# EAGLE schematic The Breadboard Version (EAGLE 9.6.0)
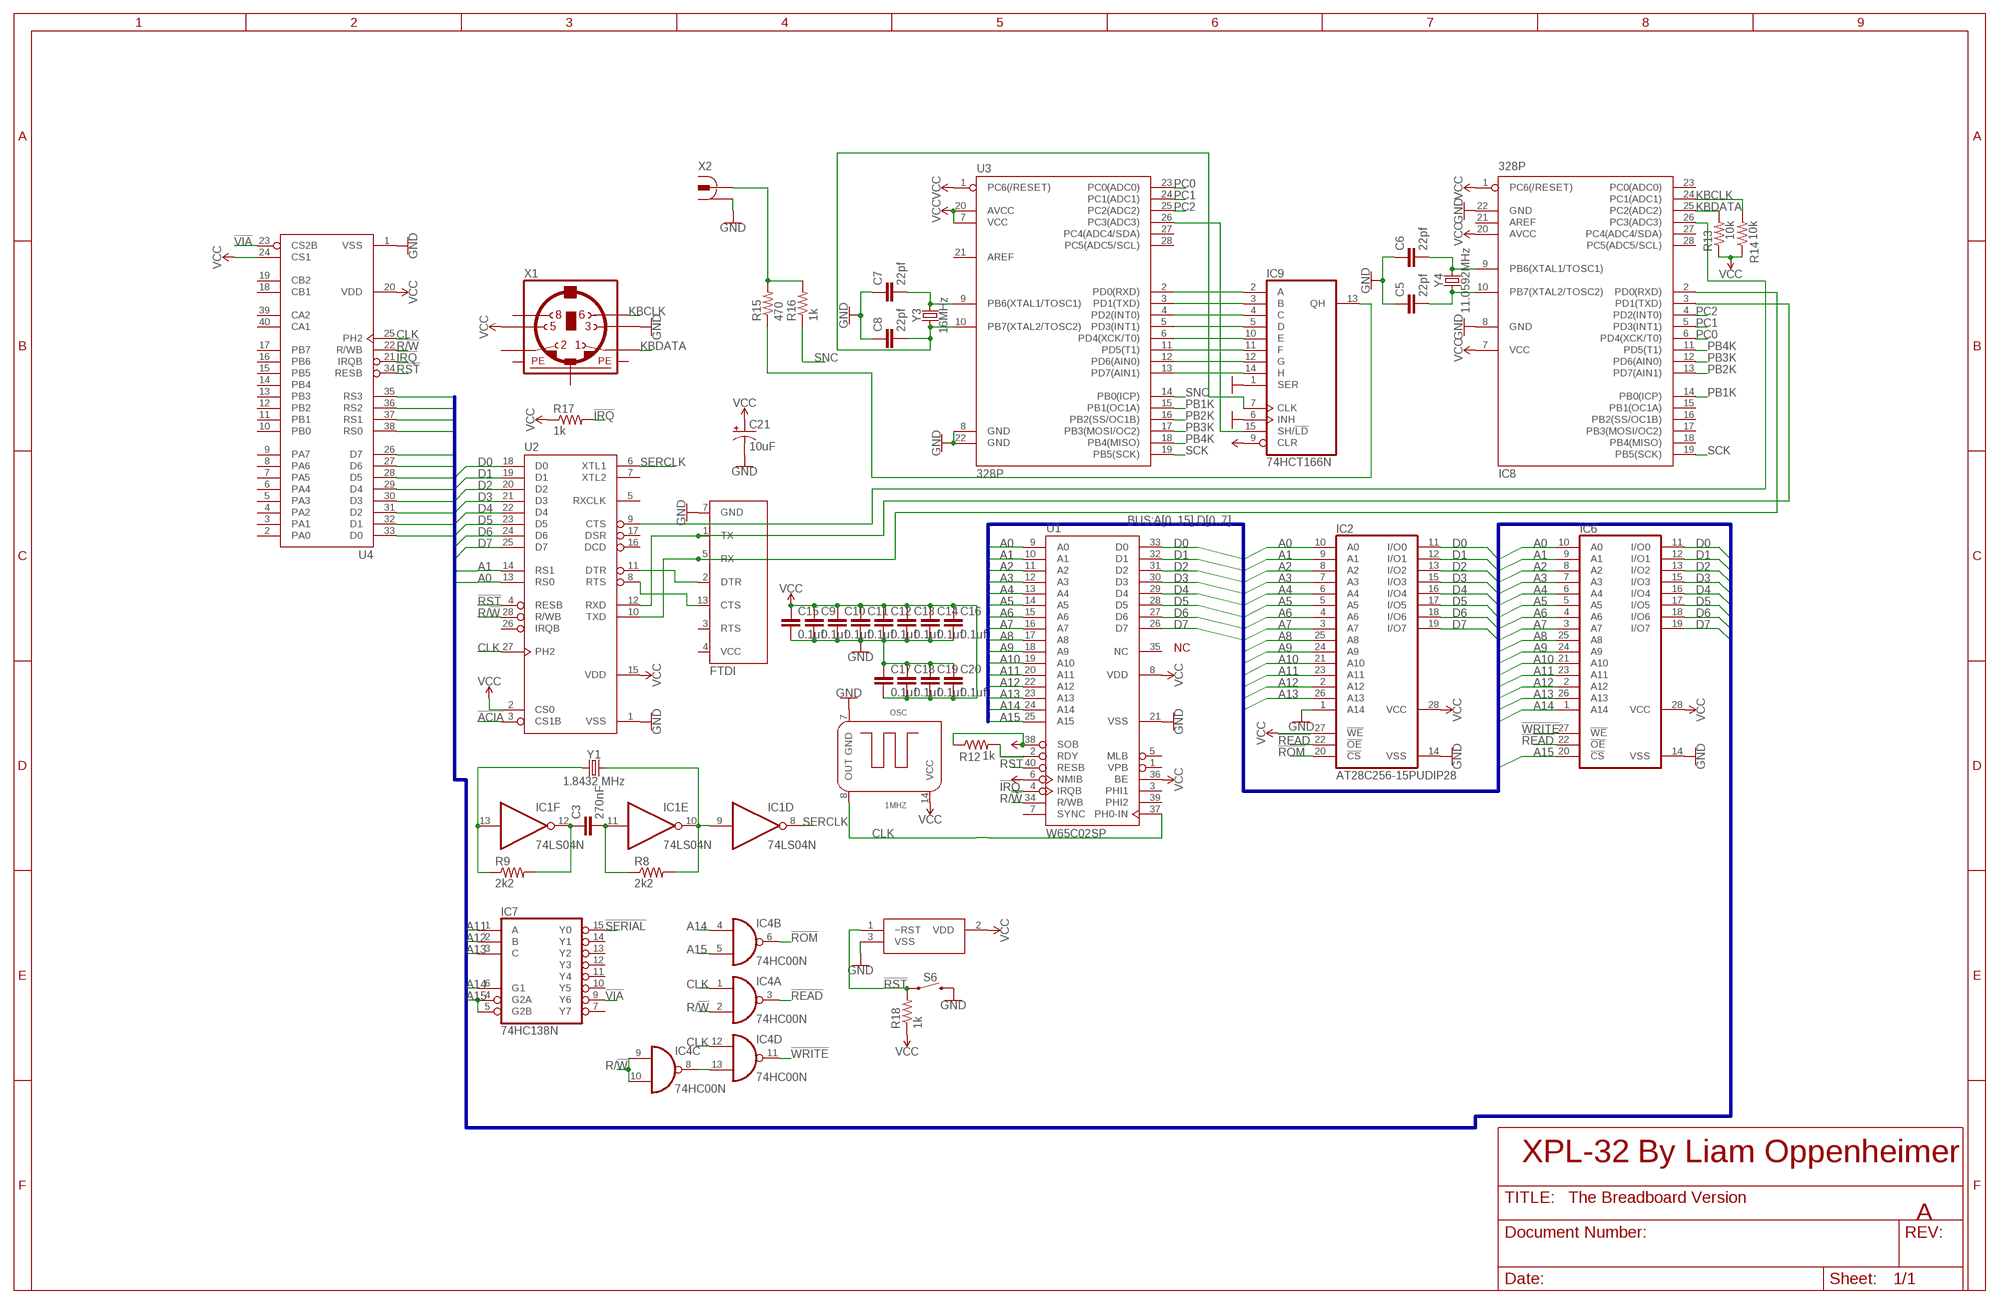
[diagram p0: schematic, sheet 1]

## Parts
1MHZ  OSC  [OSCCAN]
C3  270nF  C-EU025-025X050  [C025-025X050]
C5  22pf  C-EU025-025X050  [C025-025X050]
C6  22pf  C-EU025-025X050  [C025-025X050]
C7  22pf  C-EU025-025X050  [C025-025X050]
C8  22pf  C-EU025-025X050  [C025-025X050]
C9  0.1uf  C-EU025-025X050  [C025-025X050]
C10  0.1uf  C-EU025-025X050  [C025-025X050]
C11  0.1uf  C-EU025-025X050  [C025-025X050]
C12  0.1uf  C-EU025-025X050  [C025-025X050]
C13  0.1uf  C-EU025-025X050  [C025-025X050]
C14  0.1uf  C-EU025-025X050  [C025-025X050]
C15  0.1uf  C-EU025-025X050  [C025-025X050]
C16  0.1uf  C-EU025-025X050  [C025-025X050]
C17  0.1uf  C-EU025-025X050  [C025-025X050]
C18  0.1uf  C-EU025-025X050  [C025-025X050]
C19  0.1uf  C-EU025-025X050  [C025-025X050]
C20  0.1uf  C-EU025-025X050  [C025-025X050]
C21  10uF  CPOL-USE2.5-7  [E2,5-7]
IC1  74LS04N  [DIL14]
IC2  AT28C256-15PUDIP28  [DIP-28]
IC4  74HC00N  [DIL14]
IC6  62256P  [DIL28-6]
IC7  74HC138N  [DIL16]
IC8  328P  MEGA8-P  [DIL28-3]
IC9  74HCT166N  74LS166N  [DIL16]
IC10  MCP120-450DI_TO  [TO127P254X495-3]
R8  2k2  R-US_0204/7  [0204/7]
R9  2k2  R-US_0204/7  [0204/7]
R12  1k  R-US_0204/7  [0204/7]
R13  10k  R-US_0204/7  [0204/7]
R14  10k  R-US_0204/7  [0204/7]
R15  470  R-US_0204/7  [0204/7]
R16  1k  R-US_0204/7  [0204/7]
R17  1k  R-US_0204/7  [0204/7]
R18  1k  R-US_0204/7  [0204/7]
S6  MOMENTARY-SWITCH-SPST-PTH-6.0MM  [TACTILE_SWITCH_PTH_6.0MM]
U1  W65C02SP  [DIP-40]
U2  G65SC51P  [DIP-28]
U3  328P  ATMEGA328P_PDIP  [DIP28]
U4  G65SC22P  [DIP-40]
U6  FTDI  [FTDI]
X1  MINI_DIN_6  [M_DIN6]
X2  736880-49  [736880-49]
Y1  1.8432 MHz  CRYSTALPTH-HC49UV  [HC49U]
Y3  16MHz  CRYSTALPTH-HC49UV  [HC49U]
Y4  11.0592MHz  CRYSTALPTH-HC49UV  [HC49U]

## Nets
!ACIA: U2.3(CS1B)
!IRQ: R17.2 U1.4(IRQB) U4.21(IRQB)
!READ: IC2.22(!OE) IC4.3(A:O) IC6.22(!OE)
!ROM: IC2.20(!CS) IC4.6(B:O)
!RST: IC10.1(~RST) R18.2 S6.1 U1.40(RESB) U2.4(RESB) U4.34(RESB)
!SERIAL: IC7.15(Y0)
!VIA: IC7.9(Y6) U4.23(CS2B)
!WRITE: IC4.11(D:O) IC6.27(!WE)
A0: IC2.10(A0) IC6.10(A0) U1.9(A0) U2.13(RS0) U4.38(RS0)
A1: IC2.9(A1) IC6.9(A1) U1.10(A1) U2.14(RS1) U4.37(RS1)
A2: IC2.8(A2) IC6.8(A2) U1.11(A2) U4.36(RS2)
A3: IC2.7(A3) IC6.7(A3) U1.12(A3) U4.35(RS3)
A4: IC2.6(A4) IC6.6(A4) U1.13(A4)
A5: IC2.5(A5) IC6.5(A5) U1.14(A5)
A6: IC2.4(A6) IC6.4(A6) U1.15(A6)
A7: IC2.3(A7) IC6.3(A7) U1.16(A7)
A8: IC2.25(A8) IC6.25(A8) U1.17(A8)
A9: IC2.24(A9) IC6.24(A9) U1.18(A9)
A10: IC2.21(A10) IC6.21(A10) U1.19(A10)
A11: IC2.23(A11) IC6.23(A11) IC7.1(A) U1.20(A11)
A12: IC2.2(A12) IC6.2(A12) IC7.2(B) U1.22(A12)
A13: IC2.26(A13) IC6.26(A13) IC7.3(C) U1.23(A13)
A14: IC4.4(B:I0) IC6.1(A14) IC7.6(G1) U1.24(A14)
A15: IC4.5(B:I1) IC6.20(!CS) IC7.4(G2A) IC7.5(G2B) U1.25(A15)
CLK: 1MHZ.8(OUT) IC4.1(A:I0) IC4.12(D:I0) U1.37(PH0-IN) U2.27(PH2) U4.25(PH2)
D0: IC2.11(I/O0) IC6.11(I/O0) U1.33(D0) U2.18(D0) U4.33(D0)
D1: IC2.12(I/O1) IC6.12(I/O1) U1.32(D1) U2.19(D1) U4.32(D1)
D2: IC2.13(I/O2) IC6.13(I/O2) U1.31(D2) U2.20(D2) U4.31(D2)
D3: IC2.15(I/O3) IC6.15(I/O3) U1.30(D3) U2.21(D3) U4.30(D3)
D4: IC2.16(I/O4) IC6.16(I/O4) U1.29(D4) U2.22(D4) U4.29(D4)
D5: IC2.17(I/O5) IC6.17(I/O5) U1.28(D5) U2.23(D5) U4.28(D5)
D6: IC2.18(I/O6) IC6.18(I/O6) U1.27(D6) U2.24(D6) U4.27(D6)
D7: IC2.19(I/O7) IC6.19(I/O7) U1.26(D7) U2.25(D7) U4.26(D7)
GND: 1MHZ.7(GND) C5.1 C6.1 C7.1 C8.1 C9.2 C10.2 C11.2 C12.2 C13.2 C14.2 C15.2 C16.2 C17.1 C18.1 C19.1 C20.1 C21.- IC2.1(A14) IC2.14(VSS) IC6.14(VSS) IC8.8(GND) IC8.22(GND) IC9.1(SER) IC9.6(INH) IC10.3(VSS) S6.3 U1.21(VSS) U2.1(VSS) U3.8(GND) U3.22(GND) U4.1(VSS) U6.7(GND) X1.3 X2.1 X2.1@1 X2.1@2
KBCLK: IC8.24(PC1(ADC1)) R14.2 X1.6
KBDATA: IC8.25(PC2(ADC2)) R13.2 X1.1
N$7: IC4.8(C:O) IC4.13(D:I1)
N$12: IC1.9(D:I) IC1.10(E:O) R8.2 Y1.2
N$14: IC8.3(PD1(TXD)) U2.12(RXD) U6.1(TX)
N$15: C3.2 IC1.11(E:I) R8.1
N$17: U2.11(DTR) U6.2(DTR)
N$20: C3.1 IC1.12(F:O) R9.2
N$21: IC1.13(F:I) R9.1 Y1.1
N$22: R12.2 U1.2(RDY)
N$27: U2.8(RTS) U6.13(CTS)
N$31: C6.2 IC8.9(PB6(XTAL1/TOSC1)) Y4.2
N$32: C5.2 IC8.10(PB7(XTAL2/TOSC2)) Y4.1
N$33: C7.2 U3.9(PB6(XTAL1/TOSC1)) Y3.2
N$34: C8.2 IC9.7(CLK) U3.10(PB7(XTAL2/TOSC2)) Y3.1
N$35: IC8.26(PC3(ADC3)) U2.9(CTS)
N$36: IC9.15(SH/!LD) U3.26(PC3(ADC3))
N$40: R15.2 R16.2 X2.2
N$63: IC9.2(A) U3.2(PD0(RXD))
N$64: IC9.3(B) U3.3(PD1(TXD))
N$65: IC9.4(C) U3.4(PD2(INT0))
N$66: IC9.5(D) U3.5(PD3(INT1))
N$67: IC9.10(E) U3.6(PD4(XCK/T0))
N$68: IC9.11(F) U3.11(PD5(T1))
N$69: IC9.12(G) U3.12(PD6(AIN0))
N$70: IC9.14(H) U3.13(PD7(AIN1))
N$71: IC9.13(QH) R15.1
N$74: IC8.2(PD0(RXD)) U2.10(TXD) U6.5(RX)
PB1K: IC8.14(PB0(ICP)) U3.15(PB1(OC1A))
PB2K: IC8.13(PD7(AIN1)) U3.16(PB2(SS/OC1B))
PB3K: IC8.12(PD6(AIN0)) U3.17(PB3(MOSI/OC2))
PB4K: IC8.11(PD5(T1)) U3.18(PB4(MISO))
PC0: IC8.6(PD4(XCK/T0)) U3.23(PC0(ADC0))
PC1: IC8.5(PD3(INT1)) U3.24(PC1(ADC1))
PC2: IC8.4(PD2(INT0)) U3.25(PC2(ADC2))
R/!W: IC4.2(A:I1) IC4.9(C:I0) IC4.10(C:I1) U1.34(R/WB) U2.28(R/WB) U4.22(R/WB)
SCK: IC8.19(PB5(SCK)) U3.19(PB5(SCK))
SERCLK: IC1.8(D:O) U2.6(XTL1)
SNC: R16.1 U3.14(PB0(ICP))
VCC: 1MHZ.14(VCC) C9.1 C10.1 C11.1 C12.1 C13.1 C14.1 C15.1 C16.1 C17.2 C18.2 C19.2 C20.2 C21.+ IC2.27(!WE) IC2.28(VCC) IC6.28(VCC) IC8.1(PC6(/RESET)) IC8.7(VCC) IC8.20(AVCC) IC9.9(CLR) IC10.2(VDD) R12.1 R13.1 R14.1 R17.1 R18.1 U1.6(NMIB) U1.8(VDD) U1.36(BE) U1.38(SOB) U2.2(CS0) U2.15(VDD) U3.1(PC6(/RESET)) U3.7(VCC) U3.20(AVCC) U4.20(VDD) U4.24(CS1) X1.5
Unconnected: IC1.1(A:I) IC1.2(A:O) IC1.3(B:I) IC1.4(B:O) IC1.5(C:I) IC1.6(C:O) IC7.7(Y7) IC7.10(Y5) IC7.11(Y4) IC7.12(Y3) IC7.13(Y2) IC7.14(Y1) IC8.15(PB1(OC1A)) IC8.16(PB2(SS/OC1B)) IC8.17(PB3(MOSI/OC2)) IC8.18(PB4(MISO)) IC8.21(AREF) IC8.23(PC0(ADC0)) IC8.27(PC4(ADC4/SDA)) IC8.28(PC5(ADC5/SCL)) U1.1(VPB) U1.3(PHI1) U1.5(MLB) U1.7(SYNC) U1.35(NC) U1.39(PHI2) U2.5(RXCLK) U2.7(XTL2) U2.16(DCD) U2.17(DSR) U2.26(IRQB) U3.21(AREF) U3.27(PC4(ADC4/SDA)) U3.28(PC5(ADC5/SCL)) U4.2(PA0) U4.3(PA1) U4.4(PA2) U4.5(PA3) U4.6(PA4) U4.7(PA5) U4.8(PA6) U4.9(PA7) U4.10(PB0) U4.11(PB1) U4.12(PB2) U4.13(PB3) U4.14(PB4) U4.15(PB5) U4.16(PB6) U4.17(PB7) U4.18(CB1) U4.19(CB2) U4.39(CA2) U4.40(CA1) U6.3(RTS) U6.4(VCC) X1.2 X1.8

## Buses
BUS:A[0..15],D[0..7]

## Notes on the sheet
- FTDI
- XPL-32 | By Liam Oppenheimer
- A

## Power pins joined to a net without a drawn wire
GND: IC1.7(P:GND) IC4.7(P:GND) IC7.8(GND) IC9.8(GND)
PE1: X1.SH1(PE1)
PE2: X1.SH2(PE2)
PE3: X1.SH3(PE3)
VCC: IC1.14(P:VCC) IC4.14(P:VCC) IC7.16(VCC) IC9.16(VCC)

## Library data of the parts
1MHZ = Liam's Inventions:OSC
C3 C5-C20 = rcl:C-EU: CAPACITOR, European symbol; SPICEPREFIX: C
C21 = adafruit:CPOL-US: POLARIZED CAPACITOR, American symbol
IC1 = 74xx-us:74*04: Hex INVERTER
IC2 = SamacSys_Parts:AT28C256-15PU: AT28C256-15PU, Parallel EEPROM Memory 256kbit, Parallel, 150ns 4.5 5.5 V, 28-Pin PDIP Source: Datasheet
IC4 = 74xx-eu:74*00: Quad 2-input NAND gate
IC6 = memory-hitachi:62256P: MEMORY; OC_FARNELL: unknown; OC_NEWARK: unknown
IC7 = 74xx-eu:74*138: 3-line to 8-line DECODER/DEMULTIPLEXER
IC8 = atmel:MEGA8-P: MICROCONTROLLER 8 Kbytes FLASH, 1 kbytes SRAM, 512 bytes EEPROM, USART, 4-channel 10 bit ADC, 2-channel 8 bit ADC Pin compatible with Atmega48, ATMega88, ATMega168 Source: avr.lbr; OC_FARNELL: unknown; OC_NEWARK: unknown
IC9 = 74xx-us:74*166: 8-bit parallel load SHIFT REGISTER
IC10 = SamacSys_Parts:MCP120-450DI_TO: MCU VOLT SUPERVISOR Source: Datasheet; DESCRIPTION: MCU VOLT SUPERVISOR; HEIGHT: mm; MANUFACTURER_NAME: Microchip; MANUFACTURER_PART_NUMBER: MCP120-450DI/TO; MOUSER_PART_NUMBER: 579-MCP120-450DI/TO; MOUSER_PRICE-STOCK: https://www.mouser.co.uk/ProductDetail/Microchip-Technology/MCP120-450DI-TO?qs=sX%2FisSQq3c699aLRZYrX5w%3D%3D
R8 R9 R12-R18 = adafruit:R-US_: RESISTOR, American symbol
S6 = SparkFun-Switches:MOMENTARY-SWITCH-SPST: Momentary Switch (Pushbutton) - SPST Normally-open (NO) SPST momentary switches (buttons, pushbuttons). Variants PTH-12MM - 12mm square, through-hole Momentary Pushbutton Switch - 12mm Square <https://www.sparkfun.com/products/9190> (COM-09190) PTH-6.0MM, PTH-6.0MM-KIT - 6.0mm square, through-hole Mini Pushbutton Switch <https://www.sparkfun.com/products/97> (COM-00097) KIT package intended for soldering kit's - only one side of pads' copper is exposed. PTH-RIGHT-ANGLE-KIT - Right-angle, through-hole Right Angle Tactile Button <https://www.sparkfun.com/products/10791> - Used on SparkFun BigTime Watch Kit <https://www.sparkfun.com/products/11734> SMD-12MM - 12mm square, surface-mount Tactile Button - SMD (12mm) <https://www.sparkfun.com/products/12993> (COM-12993) Used on SparkFun PicoBoard <https://www.sparkfun.com/products/11888> SMD-4.5MM - 4.5mm Square Trackball Switch Used on SparkFun Blackberry Trackballer Breakout <https://www.sparkfun.com/products/13169> SMD-4.6MMX2.8MM - 4.60mm x 2.80mm, surface mount Used on SparkFun SAMD21 Mini Breakout <https://www.sparkfun.com/products/13664> SMD-5.2MM, SMD-5.2-REDUNDANT - 5.2mm square, surface-mount Mini Pushbutton Switch - SMD <https://www.sparkfun.com/products/8720> (COM-08720) Used on Arduino Pro Mini <https://www.sparkfun.com/products/11114> REDUNDANT package connects both switch circuits together SMD-6.0X3.5MM - 6.0 x 3.5mm, surface mount Momentary Reset Switch SMD <https://www.sparkfun.com/products/8229> (COM-08229) SMD-6.2MM-TALL - 6.2mm square, surface mount Tactile Button - SMD (6mm) <https://www.sparkfun.com/products/12992> Used on SparkFun Digital Sandbox <https://www.sparkfun.com/products/12651> SMD-RIGHT-ANGLE - Right-angle, surface mount Used on SparkFun Block for Intel® Edison - Arduino <https://www.sparkfun.com/products/13036>; PROD_ID: SWCH-08441; SF_SKU: COM-00097
U1 = 65xxx:W65C02SP: Western Digital Version
U2 = 65xxx:G65SC51P: California Micro Devices Version
U3 = SparkFun-IC-Microcontroller:ATMEGA328P_PDIP: Atmel 328P Through hole ATMEGA328P uC used in the Arduino 32kb flash, 1k EEPROM, 2k SRAM Datasheet <http://www.sparkfun.com/datasheets/Components/SMD/ATMega328.pdf> SparkFun Products Storefront component: AVR 28 Pin 20MHz 32K 6A/D - ATMega328P <https://www.sparkfun.com/products/9061> (COM-09061) SparkFun Simon Says - Through-Hole Soldering Kit <https://www.sparkfun.com/products/10547> (KIT-10547) SparkFun Learn to Solder - Simon Says <https://www.sparkfun.com/products/13708> (KIT-13708) SparkFun BigTime Watch Kit <https://www.sparkfun.com/products/11734> (KIT-11734) SparkFun ClockIt <https://www.sparkfun.com/products/10930> (KIT-10930) SparkFun Serial Enabled LCD Kit <https://www.sparkfun.com/products/10097> (LCD-10097) SparkFun Simon Tilts - Through Hole Soldering Kit <https://www.sparkfun.com/products/12634> (KIT-12634) SparkFun Frequency Counter Kit <https://www.sparkfun.com/products/10140> (KIT-10140) FabFM Radio Kit <https://www.sparkfun.com/products/11043> (KIT-11043) SparkFun Binary Blaster Kit <https://www.sparkfun.com/products/12037> (KIT-12037) SparkFun Metro-Gnome <https://www.sparkfun.com/products/9236> (KIT-09236) ATmega328 with Arduino Optiboot (Uno) <https://www.sparkfun.com/products/10524> (DEV-10524); PROD_ID: IC-09136
U4 = 65xxx:G65SC22P: California Micro Devices Version
U6 = Liam's Inventions:FTDI
X1 = mini_din:MINI_DIN_6
X2 = con-conrad:736880-49: Cinch Connector ( RCA Jack ) Cinch-Einbaukupplung 90º 72345 Vernickelt BKL Electronic Source: Conrad <http://www.conrad.de/ce/de/product/736880>
Y1 Y3 Y4 = SparkFun-Clocks:CRYSTAL: Crystals (Generic) These are passive quartz crystals, which can be used as a clock source for a microcontroller. Crystal's are two-terminal devices. They require external "load" capacitors to generate an oscillating signal.